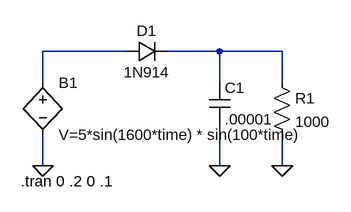
[diagram p0: schematic EnvelopeDetector.asc]
EnvelopeDetector.asc, the LTspice schematic file:
Version 4
SHEET 1 880 680
WIRE 48 48 -80 48
WIRE 192 48 112 48
WIRE 288 48 192 48
WIRE -80 96 -80 48
WIRE 192 96 192 48
WIRE 288 96 288 48
WIRE -80 224 -80 176
WIRE 192 224 192 160
WIRE 288 224 288 176
FLAG 192 224 0
FLAG 288 224 0
FLAG -80 224 0
SYMBOL diode 48 64 R270
WINDOW 0 32 32 VTop 2
WINDOW 3 0 32 VBottom 2
SYMATTR InstName D1
SYMATTR Value 1N914
SYMBOL cap 176 96 R0
SYMATTR InstName C1
SYMATTR Value .00001
SYMBOL res 272 80 R0
SYMATTR InstName R1
SYMATTR Value 1000
SYMBOL bv -80 80 R0
SYMATTR InstName B1
SYMATTR Value V=5*sin(1600*time) * sin(100*time)
TEXT -114 248 Left 2 !.tran 0 .2 0 .1

The netlist it stands for:
* EnvelopeDetector.asc
D1 N001 N002 1N914
C1 N002 0 .00001
R1 N002 0 1000
B1 N001 0 V=5*sin(1600*time) * sin(100*time)
.model D D
.lib standard.dio
.tran 0 .2 0 .1
.backanno
.end